# Altium schematic sheet BMS_controller.SchDoc
size 594 x 420 mm; SheetNumber: 5; SheetTotal: 5
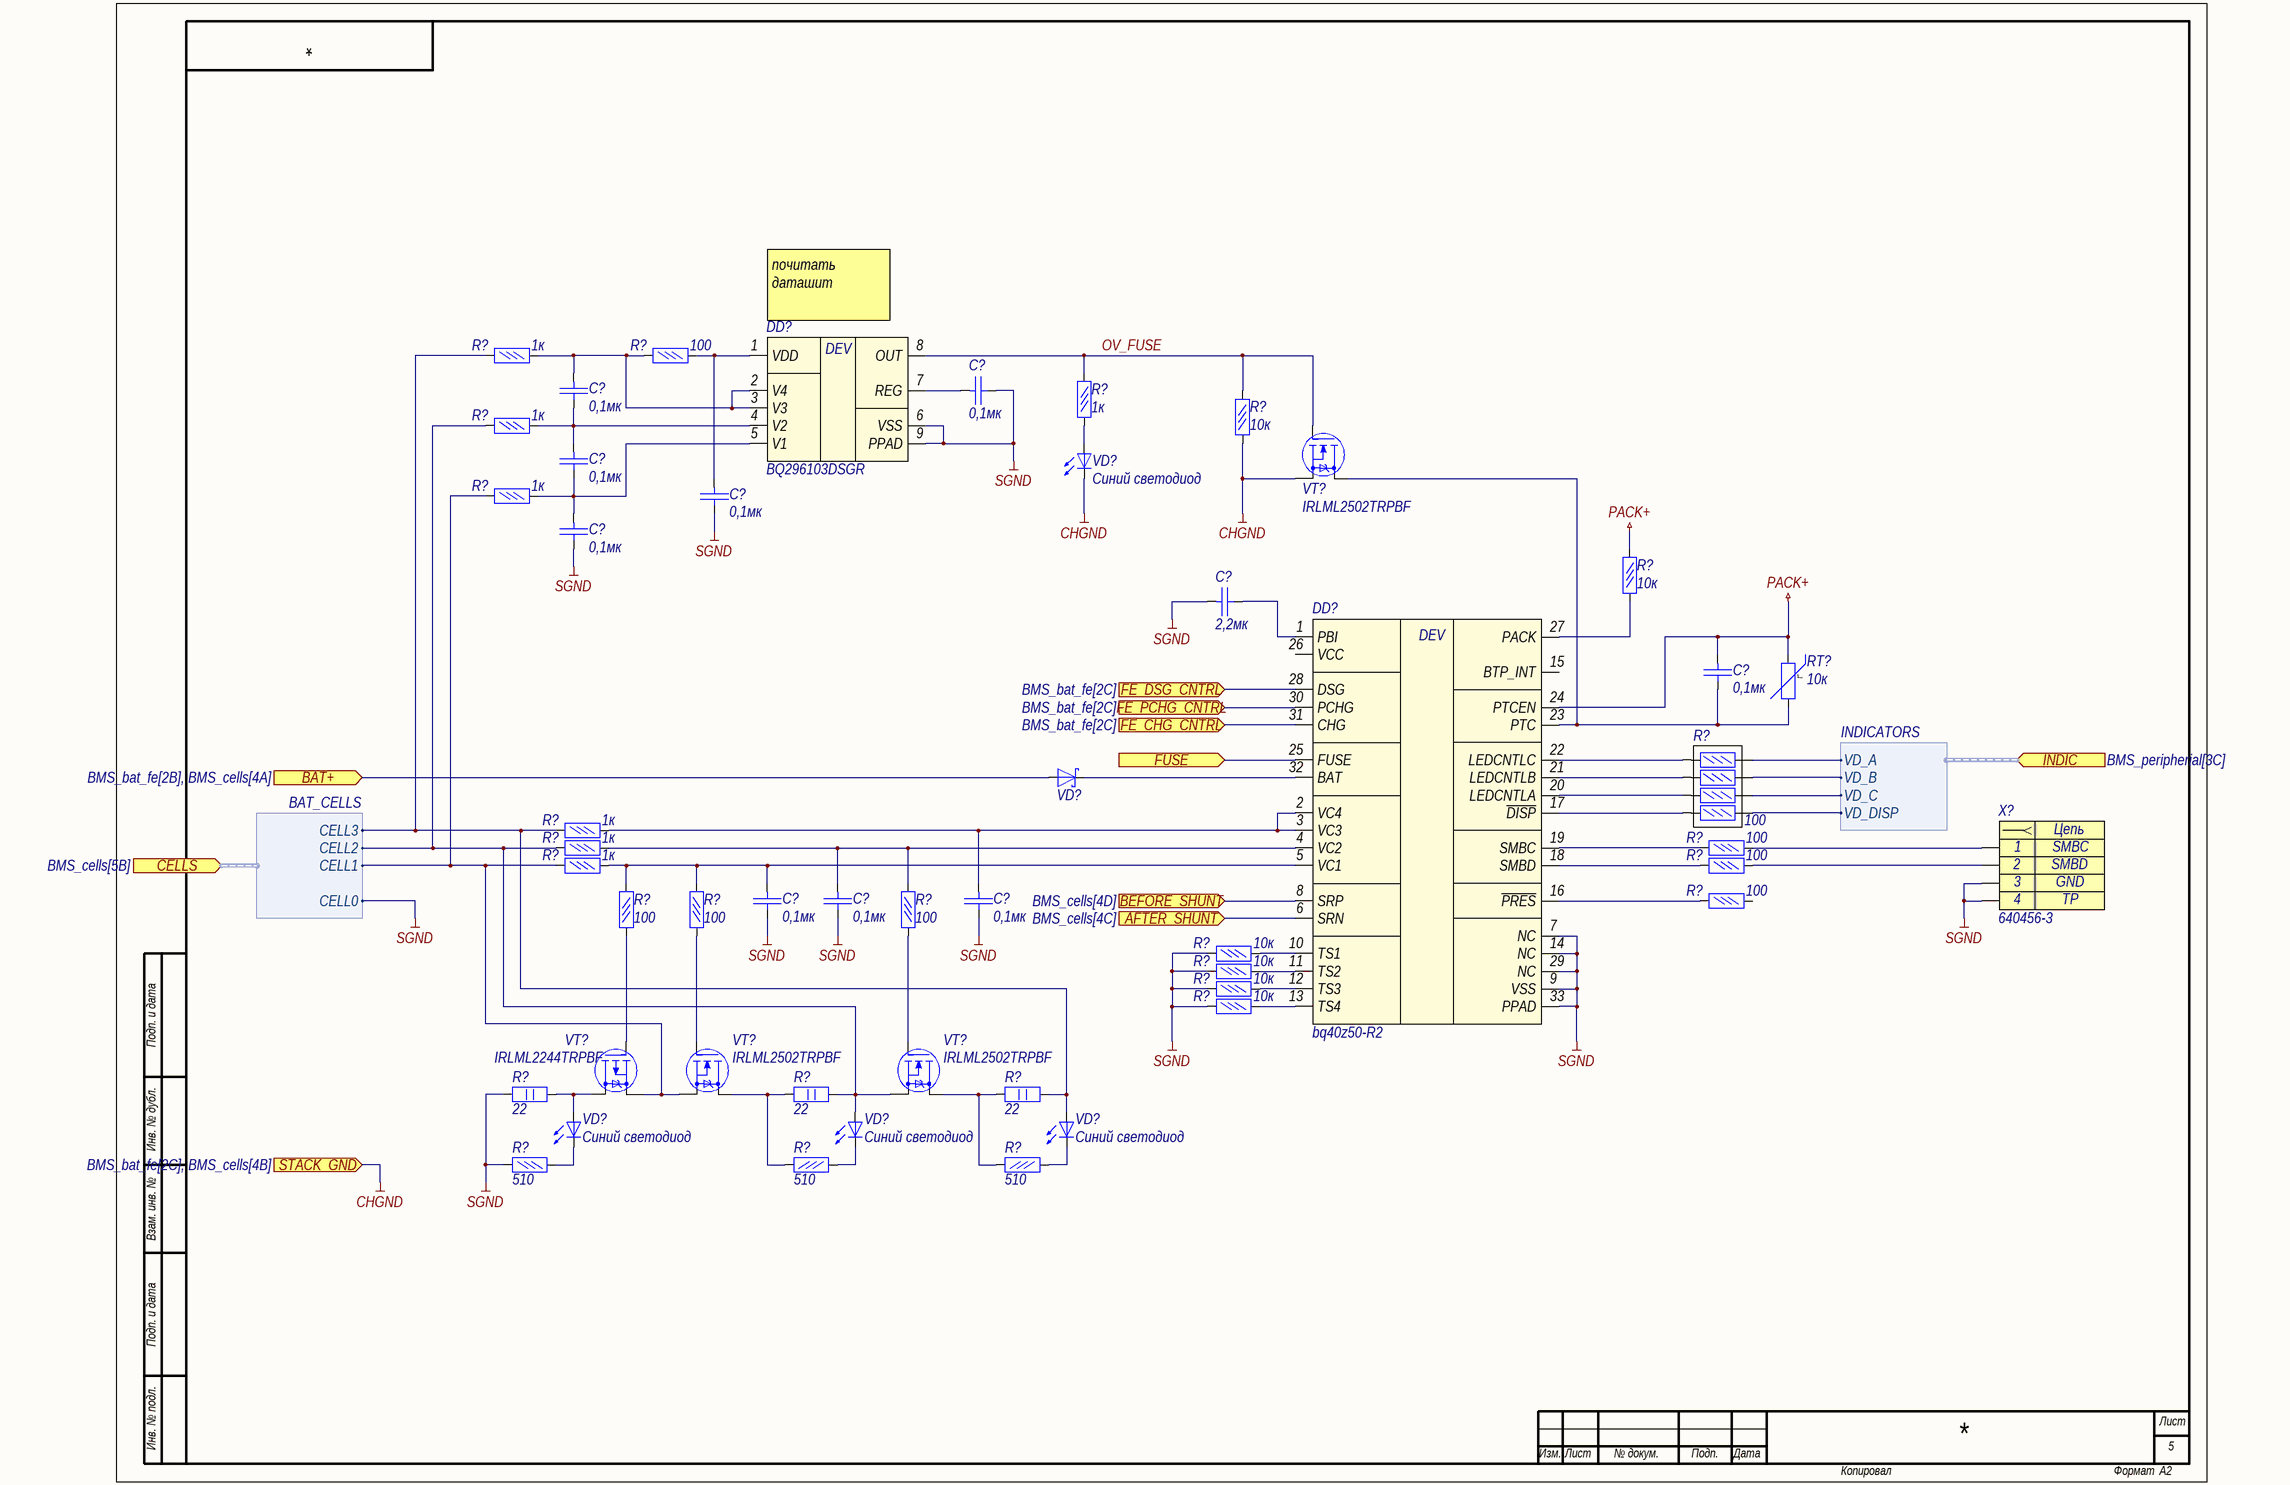
[diagram p0: BMS_controller.SchDoc]

## Parts
(Parts that share a designator on the sheet are numbered #1, #2 ... from top to bottom, then left to right.)
DD?#1  BQ296103DSGR  [WSON-8]
DD?#2  bq40z50-R2  [RSM (S-PVQFN-N32)]
R?#1  1к  [R0603]
R?#2  100  [R0603]
R?#3  10к  [R0603]
R?#4  1к  [R0603]
R?#5  1к  [R0603]
R?#6  1к  [R0603]
R?#7  10к  [R0603]
R?#8  100  [R0603X4]
R?#9  1к  [R0603]
R?#10  1к  [R0603]
R?#11  100  [R0603]
R?#12  1к  [R0603]
R?#13  100  [R0603]
R?#14  100  [R0603]
R?#15  100  [R0603]
R?#16  100  [R0603]
R?#17  100  [R0603]
R?#18  10к  [R0603]
R?#19  10к  [R0603]
R?#20  10к  [R0603]
R?#21  10к  [R0603]
R?#22  22  [R2512]
R?#23  22  [R2512]
R?#24  22  [R2512]
R?#25  510  [R0603]
R?#26  510  [R0603]
R?#27  510  [R0603]
RT?  10к  [R1206]
VD?#1  Синий светодиод  [0603 - led]
VD?#2  *  [SOD323]  (value not drawn)
VD?#3  Синий светодиод  [0603 - led]
VD?#4  Синий светодиод  [0603 - led]
VD?#5  Синий светодиод  [0603 - led]
VT?#1  IRLML2502TRPBF  [SOT23]
VT?#2  IRLML2244TRPBF  [SOT23]
VT?#3  IRLML2502TRPBF  [SOT23]
VT?#4  IRLML2502TRPBF  [SOT23]
X?  640456-3  [JST-640456-3]
С?#1  0,1мк  [C0603]
С?#2  0,1мк  [C0603]
С?#3  0,1мк  [C0603]
С?#4  0,1мк  [C0603]
С?#5  0,1мк  [C0603]
С?#6  2,2мк  [C0603]
С?#7  0,1мк  [C0603]
С?#8  0,1мк  [C0603]
С?#9  0,1мк  [C0603]
С?#10  0,1мк  [C0603]

## Ports
AFTER_SHUNT (in, see BMS_cells[4C]), BAT+ (in, see BMS_bat_fe[2B], BMS_cells[4A]), BEFORE_SHUNT (in, see BMS_cells[4D]), CELLS (in, harness BAT_CELLS, see BMS_cells[5B]), FE_CHG_CNTRL (in, see BMS_bat_fe[2C]), FE_DSG_CNTRL (in, see BMS_bat_fe[2C]), FE_PCHG_CNTRL (in, see BMS_bat_fe[2C]), FUSE (in), INDIC (in, harness INDICATORS, see BMS_peripherial[3C]), STACK_GND (in, see BMS_bat_fe[2C], BMS_cells[4B])

## Harnesses
BAT_CELLS: CELL0, CELL1, CELL2, CELL3
INDICATORS: VD_A, VD_B, VD_C, VD_DISP

## Nets
CHGND: R?#3.2 VD?#1.2(K) VT?#1.2(S) ; port STACK_GND
PACK+: DD?#2.24(PTCEN) R?#7.2 RT?.1 С?#7.2
SGND: DD?#1.6(VSS) DD?#1.9(PPAD) DD?#2.7(NC) DD?#2.9(VSS) DD?#2.14(NC) DD?#2.29(NC) DD?#2.33(PPAD) R?#18.1 R?#19.1 R?#20.1 R?#21.1 R?#22.2 R?#25.2 X?.0 X?.3 С?#1.1 С?#4.1 С?#5.1 С?#6.2 С?#8.1 С?#9.1 С?#10.1 ; port CELLS.CELL0
AFTER_SHUNT: DD?#2.6(SRN) ; port AFTER_SHUNT
BAT+: VD?#2.2(A) ; port BAT+
BEFORE_SHUNT: DD?#2.8(SRP) ; port BEFORE_SHUNT
FE_CHG_CNTRL: DD?#2.31(CHG) ; port FE_CHG_CNTRL
FE_DSG_CNTRL: DD?#2.28(NC) ; port FE_DSG_CNTRL
FE_PCHG_CNTRL: DD?#2.30(PCHG) ; port FE_PCHG_CNTRL
FUSE: DD?#2.25(FUSE) ; port FUSE
OV_FUSE: DD?#1.8(OUT) R?#3.1 R?#4.2 VT?#1.1(G)
NetDD?#1_1: DD?#1.1(VDD) R?#2.2 С?#4.2
NetDD?#1_2: DD?#1.2(V4) DD?#1.3(V3) R?#1.2 R?#2.1 С?#2.2
NetDD?#1_4: DD?#1.4(V2) R?#5.2 С?#2.1 С?#3.2
NetDD?#1_5: DD?#1.5(V1) R?#6.2 С?#3.1 С?#5.2
NetDD?#1_7: DD?#1.7(REG) С?#1.2
NetDD?#2_1: DD?#2.1(NC) С?#6.1
NetDD?#2_2: DD?#2.2(VC4) DD?#2.3(VC3) R?#9.2 С?#10.2
NetDD?#2_4: DD?#2.4(VC2) R?#10.2 R?#15.1 С?#9.2
NetDD?#2_5: DD?#2.5(VC1) R?#12.2 R?#13.1 R?#14.1 С?#8.2
NetDD?#2_10: DD?#2.10(TS1) R?#18.2
NetDD?#2_11: DD?#2.11(TS2) R?#19.2
NetDD?#2_12: DD?#2.12(NC) R?#20.2
NetDD?#2_13: DD?#2.13(TS4) R?#21.2
NetDD?#2_16: DD?#2.16(~{PRES}) R?#17.1
NetDD?#2_17: DD?#2.17(~{DISP}) R?#8.7
NetDD?#2_18: DD?#2.18(SMBD) R?#16.1
NetDD?#2_19: DD?#2.19(SMBC) R?#11.1
NetDD?#2_20: DD?#2.20(LEDCNTLA) R?#8.5
NetDD?#2_21: DD?#2.21(LEDCNTLB) R?#8.3
NetDD?#2_22: DD?#2.22(LEDCNTLC) R?#8.1
NetDD?#2_23: DD?#2.23(PTC) RT?.2 VT?#1.3(D) С?#7.1
NetDD?#2_27: DD?#2.27(PACK) R?#7.1
NetDD?#2_32: DD?#2.32(BAT) VD?#2.1(K)
NetR?#1_1: R?#1.1 R?#9.1 R?#24.2 VD?#5.1(A) ; port CELLS.CELL3
NetR?#4_1: R?#4.1 VD?#1.1(A)
NetR?#5_1: R?#5.1 R?#10.1 R?#23.2 VD?#4.1(A) VT?#4.2(S) ; port CELLS.CELL2
NetR?#6_1: R?#6.1 R?#12.1 VT?#2.2(S) VT?#3.2(S) ; port CELLS.CELL1
NetR?#8_2: R?#8.2 ; port INDIC.VD_A
NetR?#8_4: R?#8.4 ; port INDIC.VD_B
NetR?#8_6: R?#8.6 ; port INDIC.VD_C
NetR?#8_8: R?#8.8 ; port INDIC.VD_DISP
NetR?#11_2: R?#11.2 X?.1
NetR?#13_2: R?#13.2 VT?#2.1(G)
NetR?#14_2: R?#14.2 VT?#3.1(G)
NetR?#15_2: R?#15.2 VT?#4.1(G)
NetR?#16_2: R?#16.2 X?.2
NetR?#22_1: R?#22.1 VD?#3.1(A) VT?#2.3(D)
NetR?#23_1: R?#23.1 R?#26.2 VT?#3.3(D)
NetR?#24_1: R?#24.1 R?#27.2 VT?#4.3(D)
NetR?#25_1: R?#25.1 VD?#3.2(K)
NetR?#26_1: R?#26.1 VD?#4.2(K)
NetR?#27_1: R?#27.1 VD?#5.2(K)

Not connected (* = marked no-connect by the designer): DD?#1 15(NC) 18(NC) 27(NC); DD?#2 15(NC) 26(VCC); R?#17 2

## Notes on the sheet
- (near DD?#1) почитать даташит
- Подп. и дата
- Инв. № дубл.
- Взам. инв. №
- Инв. № подл.
- Лист
- Изм.
- № докум.
- Подп.
- Дата
- Копировал
- Формат
- А2
- (in symbol bq40z50-R1) DEV
- (in symbol BQ296103DSGR) DEV
- (in symbol Header_3) Цепь; 4
- (in symbol Термистор) t°

## Library data of the parts
DD?#1 = BQ296103DSGR: x Overvoltage Protection for 2-Series, 3-Series, and 4-Series Cell  Li-Ion Batteries; Name: BQ296103DSGR
DD?#2 = bq40z50-R1: Name: bq40z50-R2
R?#1-R?#7 R?#9-R?#21 R?#25-R?#27 = Резистор 0.05Вт: Резистор 0,05Вт
  R?#1 R?#4-R?#6 R?#9 R?#10 R?#12: Value: 1к
  R?#2 R?#11 R?#13-R?#17: Value: 100
  R?#3 R?#7 R?#18-R?#21: Value: 10к
  R?#25-R?#27: Value: 510
R?#8 = Резисторная сборка 0.05 x 4: Value: 100
R?#22-R?#24 = Резистор 2Вт: Value: 22
RT? = Термистор: Value: 10к
VD?#1 VD?#3-VD?#5 = SMD светодиод: Светодтод SMD; Name: Синий светодиод
VD?#2 = Diode Shottky: Диод Шоттки; Name: *
VT?#1 VT?#3 VT?#4 = IRLML2502TRPBF: мосфет n-канал IRLML2502TRPBF; Name: IRLML2502TRPBF
VT?#2 = IRLML2244TRPBF: мосфет p-канал IRLML2244TRPBF; Name: IRLML2244TRPBF
X? = Header_3: Разъем - 3 конт. розетка; Contact_1: SMBC; Contact_2: SMBD; Contact_3: GND; Contact_4: TP; Name: 640456-3
С?#1-С?#10 = Кер. конденсатор
  С?#1-С?#5 С?#7-С?#10: Value: 0,1мк
  С?#6: Value: 2,2мк